# Altium schematic sheet ETR_CELLMETER_SLAVE.SchDoc
size A2; SheetNumber: 1; SheetTotal: 1
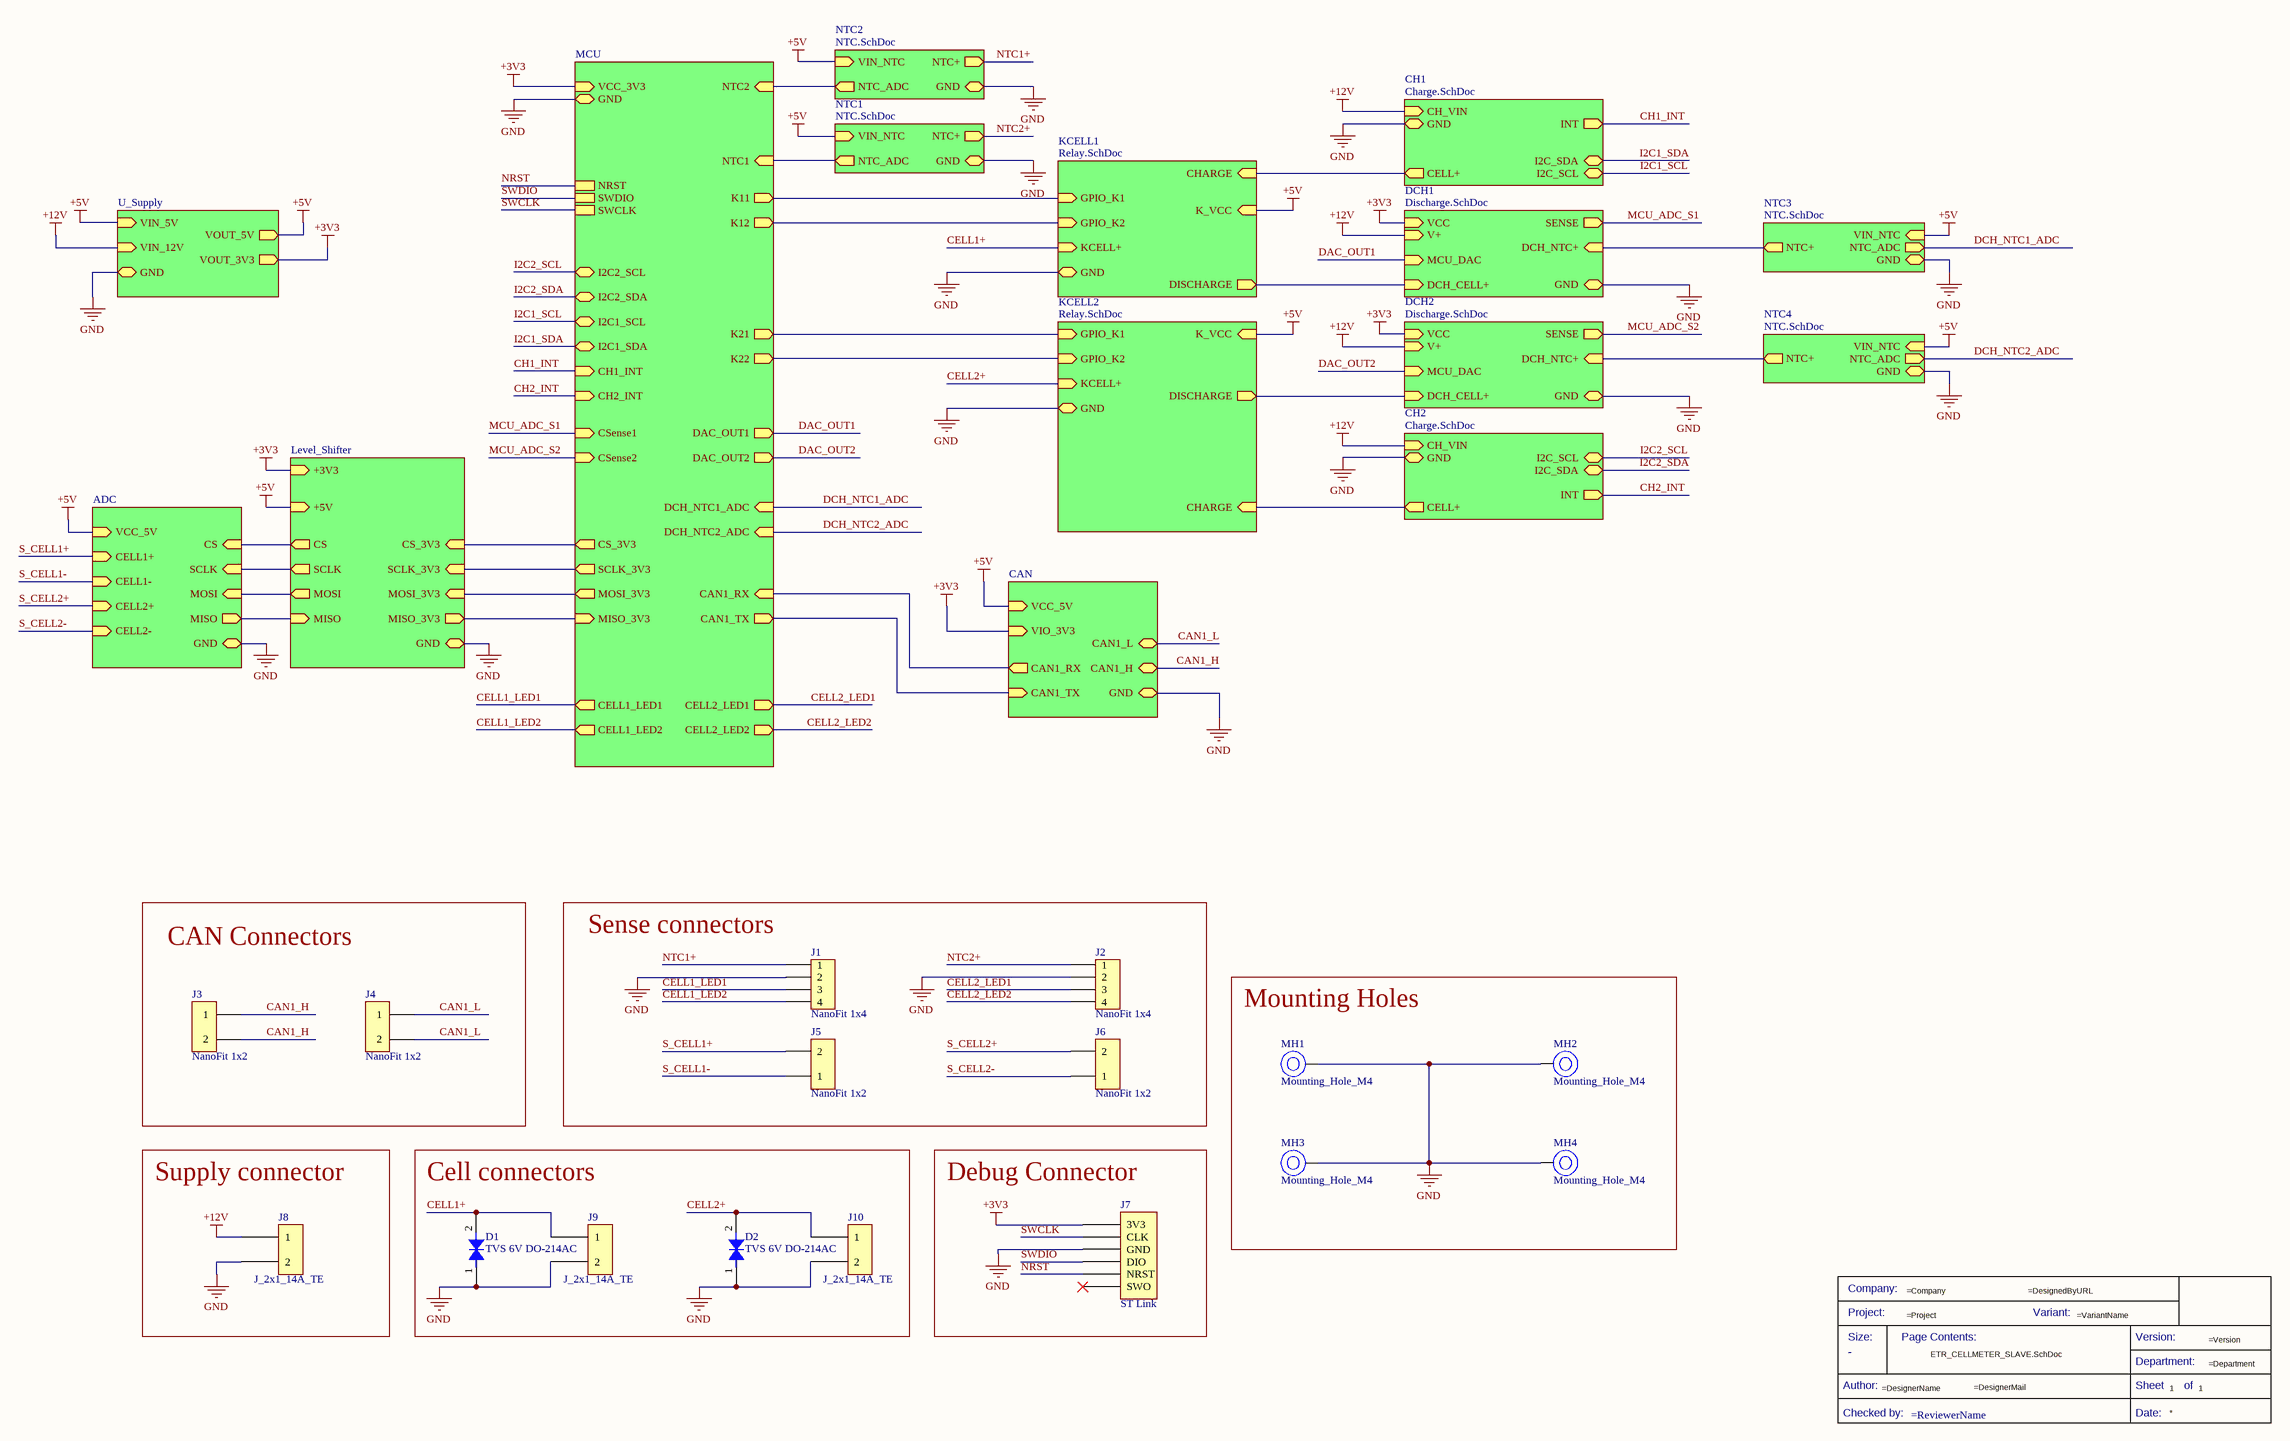
[diagram p0: ETR_CELLMETER_SLAVE.SchDoc]

## Parts
*  Title Block_template  (value not drawn)  (graphical)
D1  TVS 6V DO-214AC  [DTVS-DO-214AC]
D2  TVS 6V DO-214AC  [DTVS-DO-214AC]
J1  NanoFit 1x4  [J_NanoFit_1x4_V]
J2  NanoFit 1x4  [J_NanoFit_1x4_V]
J3  NanoFit 1x2  [FP-105309-1102-MFG]
J4  NanoFit 1x2  [FP-105309-1102-MFG]
J5  NanoFit 1x2  [FP-105309-1102-MFG]
J6  NanoFit 1x2  [FP-105309-1102-MFG]
J7  ST Link  [J_STLink_PinHeader]
J8  J_2x1_14A_TE  [179838-2]
J9  J_2x1_14A_TE  [179838-2]
J10  J_2x1_14A_TE  [179838-2]
MH1  Mounting_Hole_M4  [Mounting_Hole_M4]
MH2  Mounting_Hole_M4  [Mounting_Hole_M4]
MH3  Mounting_Hole_M4  [Mounting_Hole_M4]
MH4  Mounting_Hole_M4  [Mounting_Hole_M4]

## Blocks framed on the sheet
CAN Connectors: J3 J4
Sense connectors: J1 J2 J5 J6
Mounting Holes: MH1-MH4
Supply connector: J8
Cell connectors: D1 D2 J9 J10
Debug Connector: J7

## Sub-sheets
ADC = ADC: SCLK (in), CS (in), MOSI (in), MISO (out), CELL2+ (in), CELL2- (in), CELL1- (in), CELL1+ (in), VCC_5V (in), GND (bidir)
CAN = CAN.SchDoc: CAN1_L (bidir), CAN1_H (bidir), CAN1_RX (out), CAN1_TX (in), VCC_5V (in), VIO_3V3 (in), GND (bidir)
CH1 = Charge.SchDoc: CELL+ (out), CH_VIN (in), INT (out), I2C_SCL (bidir), I2C_SDA (bidir), GND (bidir)
CH2 = Charge.SchDoc: CELL+ (out), CH_VIN (in), INT (out), I2C_SCL (bidir), I2C_SDA (bidir), GND (bidir)
DCH1 = Discharge.SchDoc: SENSE (out), VCC (in), V+ (in), MCU_DAC (in), DCH_CELL+ (in), GND (bidir), DCH_NTC+ (in)
DCH2 = Discharge.SchDoc: SENSE (out), VCC (in), V+ (in), MCU_DAC (in), DCH_CELL+ (in), GND (bidir), DCH_NTC+ (in)
KCELL1 = Relay.SchDoc: GPIO_K2 (in), GPIO_K1 (in), KCELL+ (in), DISCHARGE (out), CHARGE (in), GND (bidir), K_VCC (in)
KCELL2 = Relay.SchDoc: GPIO_K2 (in), GPIO_K1 (in), KCELL+ (in), DISCHARGE (out), CHARGE (in), GND (bidir), K_VCC (in)
Level_Shifter = Level_Shifter: MISO_3V3 (out), MOSI (out), CS (out), SCLK (out), CS_3V3 (in), MOSI_3V3 (in), SCLK_3V3 (in), +3V3 (in), +5V (in), MISO (in), GND (bidir)
MCU = MCU: VCC_3V3 (in), NRST, K11 (out), K12 (out), CAN1_RX (in), CAN1_TX (out), K22 (out), K21 (out), CS_3V3 (out), DAC_OUT1 (out), DAC_OUT2 (out), SWDIO, SWCLK, I2C1_SCL (bidir), I2C1_SDA (bidir), SCLK_3V3 (out), MISO_3V3 (in), MOSI_3V3 (out), GND (bidir), NTC1 (in), NTC2 (in), I2C2_SCL (bidir), I2C2_SDA (bidir), CH1_INT (in), CH2_INT (in), CSense1 (in), CSense2 (in), DCH_NTC1_ADC (in), DCH_NTC2_ADC (in), CELL1_LED1 (out), CELL1_LED2 (out), CELL2_LED1 (out), CELL2_LED2 (out)
NTC1 = NTC.SchDoc: VIN_NTC (in), NTC_ADC (out), NTC+ (out), GND (bidir)
NTC2 = NTC.SchDoc: VIN_NTC (in), NTC_ADC (out), NTC+ (out), GND (bidir)
NTC3 = NTC.SchDoc: NTC+ (out), VIN_NTC (in), NTC_ADC (out), GND (bidir)
NTC4 = NTC.SchDoc: NTC+ (out), VIN_NTC (in), NTC_ADC (out), GND (bidir)
U_Supply = Supply.SchDoc: VIN_12V (in), VOUT_5V (out), VOUT_3V3 (out), GND (bidir), VIN_5V (in)

## Nets
+3V3: J7.1(3V3) ; sheet Level_Shifter/+3V3, sheet CAN/VIO_3V3, sheet MCU/VCC_3V3, sheet U_Supply/VOUT_3V3, sheet DCH1/VCC, sheet DCH2/VCC
+5V: sheet ADC/VCC_5V, sheet Level_Shifter/+5V, sheet CAN/VCC_5V, sheet U_Supply/VOUT_5V, sheet U_Supply/VIN_5V, sheet KCELL1/K_VCC, sheet KCELL2/K_VCC, sheet NTC1/VIN_NTC, sheet NTC2/VIN_NTC, sheet NTC4/VIN_NTC, sheet NTC3/VIN_NTC
+12V: J8.1 ; sheet U_Supply/VIN_12V, sheet DCH1/V+, sheet DCH2/V+, sheet CH2/CH_VIN, sheet CH1/CH_VIN
GND: D1.1 D2.1 J1.2 J2.2 J7.3(GND) J8.2 J9.2 J10.2 MH1.1 MH2.1 MH3.1 MH4.1 ; sheet ADC/GND, sheet Level_Shifter/GND, sheet CAN/GND, sheet MCU/GND, sheet U_Supply/GND, sheet KCELL1/GND, sheet KCELL2/GND, sheet DCH1/GND, sheet DCH2/GND, sheet CH2/GND, sheet CH1/GND, sheet NTC1/GND, sheet NTC2/GND, sheet NTC4/GND, sheet NTC3/GND
CAN1_H: J3.1 J3.2 ; sheet CAN/CAN1_H
CAN1_L: J4.1 J4.2 ; sheet CAN/CAN1_L
CELL1+: D1.2 J9.1 ; sheet KCELL1/KCELL+
CELL1_LED1: J1.3 ; sheet MCU/CELL1_LED1
CELL1_LED2: J1.4 ; sheet MCU/CELL1_LED2
CELL2+: D2.2 J10.1 ; sheet KCELL2/KCELL+
CELL2_LED1: J2.3 ; sheet MCU/CELL2_LED1
CELL2_LED2: J2.4 ; sheet MCU/CELL2_LED2
CH1_INT: sheet MCU/CH1_INT, sheet CH1/INT
CH2_INT: sheet MCU/CH2_INT, sheet CH2/INT
DAC_OUT1: sheet MCU/DAC_OUT1, sheet DCH1/MCU_DAC
DAC_OUT2: sheet MCU/DAC_OUT2, sheet DCH2/MCU_DAC
DCH_NTC1_ADC: sheet MCU/DCH_NTC1_ADC, sheet NTC3/NTC_ADC
DCH_NTC2_ADC: sheet MCU/DCH_NTC2_ADC, sheet NTC4/NTC_ADC
I2C1_SCL: sheet MCU/I2C1_SCL, sheet CH1/I2C_SCL
I2C1_SDA: sheet MCU/I2C1_SDA, sheet CH1/I2C_SDA
I2C2_SCL: sheet MCU/I2C2_SCL, sheet CH2/I2C_SCL
I2C2_SDA: sheet MCU/I2C2_SDA, sheet CH2/I2C_SDA
MCU_ADC_S1: sheet MCU/CSense1, sheet DCH1/SENSE
MCU_ADC_S2: sheet MCU/CSense2, sheet DCH2/SENSE
NRST: J7.5(NRST) ; sheet MCU/NRST
NTC1+: J1.1 ; sheet NTC2/NTC+
NTC2+: J2.1 ; sheet NTC1/NTC+
S_CELL1+: J5.2 ; sheet ADC/CELL1+
S_CELL1-: J5.1 ; sheet ADC/CELL1-
S_CELL2+: J6.2 ; sheet ADC/CELL2+
S_CELL2-: J6.1 ; sheet ADC/CELL2-
SWCLK: J7.2(CLK) ; sheet MCU/SWCLK
SWDIO: J7.4(DIO) ; sheet MCU/SWDIO
(unnamed): sheet ADC/SCLK, sheet Level_Shifter/SCLK
(unnamed): sheet ADC/CS, sheet Level_Shifter/CS
(unnamed): sheet ADC/MOSI, sheet Level_Shifter/MOSI
(unnamed): sheet ADC/MISO, sheet Level_Shifter/MISO
(unnamed): sheet Level_Shifter/MISO_3V3, sheet MCU/MISO_3V3
(unnamed): sheet Level_Shifter/CS_3V3, sheet MCU/CS_3V3
(unnamed): sheet Level_Shifter/MOSI_3V3, sheet MCU/MOSI_3V3
(unnamed): sheet Level_Shifter/SCLK_3V3, sheet MCU/SCLK_3V3
(unnamed): sheet CAN/CAN1_RX, sheet MCU/CAN1_RX
(unnamed): sheet CAN/CAN1_TX, sheet MCU/CAN1_TX
(unnamed): sheet MCU/K11, sheet KCELL1/GPIO_K1
(unnamed): sheet MCU/K12, sheet KCELL1/GPIO_K2
(unnamed): sheet MCU/K22, sheet KCELL2/GPIO_K2
(unnamed): sheet MCU/K21, sheet KCELL2/GPIO_K1
(unnamed): sheet MCU/NTC1, sheet NTC1/NTC_ADC
(unnamed): sheet MCU/NTC2, sheet NTC2/NTC_ADC
(unnamed): sheet KCELL1/DISCHARGE, sheet DCH1/DCH_CELL+
(unnamed): sheet KCELL1/CHARGE, sheet CH1/CELL+
(unnamed): sheet KCELL2/DISCHARGE, sheet DCH2/DCH_CELL+
(unnamed): sheet KCELL2/CHARGE, sheet CH2/CELL+
(unnamed): sheet DCH1/DCH_NTC+, sheet NTC3/NTC+
(unnamed): sheet DCH2/DCH_NTC+, sheet NTC4/NTC+

Not connected (* = marked no-connect by the designer): J7 6(SWO)*

## Notes on the sheet
- (in symbol CMP-00043-7) Company:; Project:; Variant:; Size:; Page Contents:; Version:; Department:; Author:; Sheet; of; Checked by:; Date:

## Library data of the parts
* = CMP-00043-7: Standard Title Block; .Creator: GP; Checked by:: =ReviewerName; Size: -; Design Item ID: Title Block_template; Category: Title Block; .SCHcheck: GP; Source: e-Tech_Racing.SchLib; .PCBcheck: GP
D1 D2 = CMP-00154-1: TVS diode [Würth Elektronik] 824501600 TVS diode; Manufacturer: Wurth Electronics; Power Line Protection: No; Forward Voltage: 7.02V; Number of Bidirectional Channels: 1; Peak Pulse Current: 38.8A; .Creator: DO; Polarity: Bidirectional; Peak Pulse Power: 400W; Clamping Voltage: 10.3V; ComponentLink2Description: http://www.farnell.com/datasheets/2036401.pdf?src-supplier=Element14; Source: Filter components.SchLib; ComponentLink3URL: https://katalog.we-online.de/pbs/datasheet/824501600.pdf?src-supplier=Digi-Key; Mount: Surface Mount; Design Item ID: DTVS-6V-DO-214AC; ComponentLink3Description: https://katalog.we-online.de/pbs/datasheet/824501600.pdf?src-supplier=Digi-Key; RoHS: Yes; Resistor Type: Zener; REACH SVHC: Unknown; Pins: 2; Min Breakdown Voltage: 7.02V; Min Operating Temperature: -65°C; ComponentLink1URL: https://www.we-online.com/catalog/en/WE-TVSP?sq=824501600#824501600; Reverse Standoff Voltage: 6V; Stock 1: 780; Pricing 1: 1=0,28000, 10=0,26100, 50=0,26100, 100=0,23400, 500=0,20400, 1000=0,17400, 10000=0,17400 (USD); ComponentLink2URL: http://www.farnell.com/datasheets/2036401.pdf?src-supplier=Element14; Category: TVS Diodes; ComponentLink1Description: Where buy it; Manufacturer Part Number: 824501600; Packaging: Cut Tape; RoHS Compliant: Yes; Max Operating Temperature: 150°C
J1 J2 = CMP-00018-1: Nano-Fit Vertical Header Through Hole 2.50mm Pitch Single Row 4 Circuits with Kinked Pins 0.38; Manufacturer 1: Molex; Manufacturer Part Number 1: 105309-1204; .Creator: DO; Pricing 1: 1=1,37050, 10=1,11700, 100=0,95270, 500=0,86980, 1000=0,74060, 2500=0,71930, 5000=0,68450, 10000=0,66860 (USD); ComponentLink2URL: http://www.farnell.com/datasheets/2221349.pdf?src-supplier=Newark; ComponentLink2Description: http://www.farnell.com/datasheets/2221349.pdf?src-supplier=Newark; ComponentLink4URL: http://www.farnell.com/datasheets/2059602.pdf?src-supplier=Element14; ComponentLink3Description: http://www.literature.molex.com/SQLImages/kelmscott/Molex/PDF_Images/987651-1223.PDF?src-supplier=Digi-Key; ComponentLink1URL: http://farnell.com//datasheets/2221349.pdf?src-supplier=Farnell; Source: Electromechanical.SchLib; ComponentLink3URL: http://www.literature.molex.com/SQLImages/kelmscott/Molex/PDF_Images/987651-1223.PDF?src-supplier=Digi-Key; Category: Headers and Wire Housings; Design Item ID: J_NanoFit_1x4_V; ComponentLink4Description: http://www.farnell.com/datasheets/2059602.pdf?src-supplier=Element14; ComponentLink1Description: http://farnell.com//datasheets/2221349.pdf?src-supplier=Farnell; Stock 1: 709; RoHS: No
J3-J6 = CMP-002-00001-2: Conn HDR 2 POS 2.5mm Solder ST Thru-Hole 2 Terminal 1 Port Nano-Fit Tray
J7 = J_STLink_STM32_PinHeader_1x6
J8-J10 = CMP-002-00003-2: 179838-2; Connector Type: Power,Rectangular; Design Item ID: Power 2 pin connector; Mounting Technology: Board; RoHS Compliant: Yes; Max Operating Temperature: 105°C; Source: Electromechanical.SchLib; Min Operating Temperature: -30°C
MH1-MH4 = CMP-00041-8: Mounting Hole M4; Design Item ID: Mounting_Hole_M4; Source: Electromechanical.SchLib